# EAGLE design MainBoard (EAGLE 7.7.0)
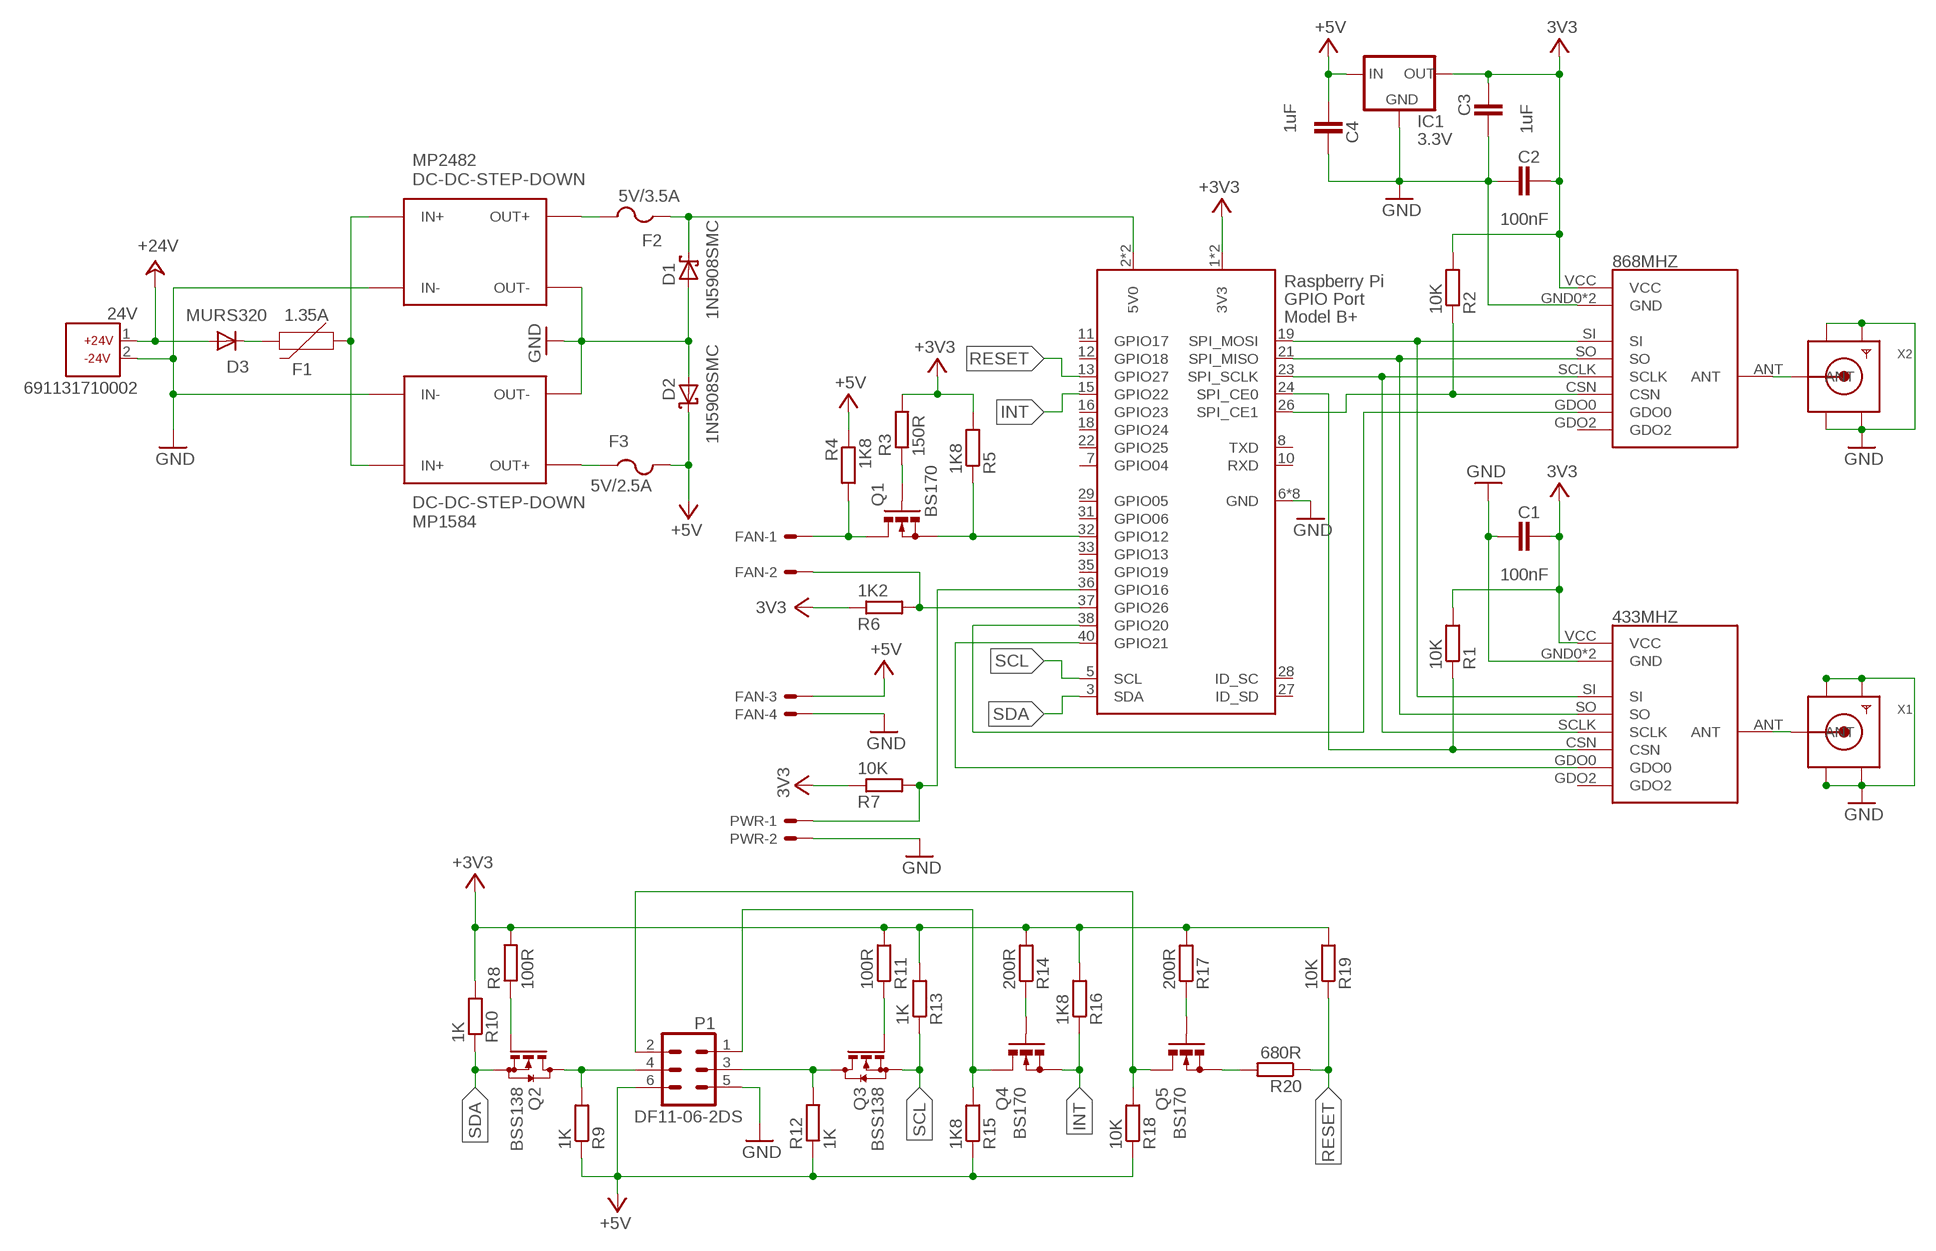
[diagram p0: schematic, sheet 1]

## Parts
24V  691131710002  [691131710002]
433MHZ  CC1101E07-SMD  [E07-M1101S-SMD]
868MHZ  CC1101E07-SMD  [E07-M1101S-SMD]
C1  100nF  C-EUC0805  [C0805]
C2  100nF  C-EUC0805  [C0805]
C3  1uF  C-EUC0805  [C0805]
C4  1uF  C-EUC0805  [C0805]
D1  1N5908SMC  [SMC]
D2  1N5908SMC  [SMC]
D3  MURS320  DIODE-SMC  [SMC]
F1  1.35A  PPTCRGEF250  [RGEF250]
F2  5V/3.5A  PTCFUSE-1812  [1812]
F3  5V/2.5A  PTCFUSE-1812  [1812]
FAN  22-23-2041  [22-23-2041]
IC1  3.3V  MCP1700TRI  [TO92]
MP1584  DC-DC-STEP-DOWN  DC-DC-STEP-DOWNMP1584-V  [MP1584V]
MP2482  DC-DC-STEP-DOWN  DC-DC-STEP-DOWNMP2482-V  [MP2482V]
P1  DF11-06-2DS  [DF11-06DP-2DS]
PWR  22-23-2021  [22-23-2021]
Q1  BS170  [SOT54E]
Q2  BSS138  BSS123  [SOT23]
Q3  BSS138  BSS123  [SOT23]
Q4  BS170  [SOT54E]
Q5  BS170  [SOT54E]
R1  10K  R-EU_0204/2V  [0204V]
R2  10K  R-EU_0204/2V  [0204V]
R3  150R  R-EU_0204/2V  [0204V]
R4  1K8  R-EU_0204/5  [0204/5]
R5  1K8  R-EU_0204/2V  [0204V]
R6  1K2  R-EU_0204/2V  [0204V]
R7  10K  R-EU_0204/2V  [0204V]
R8  100R  R-EU_0204/5  [0204/5]
R9  1K  R-EU_0204/2V  [0204V]
R10  1K  R-EU_0204/5  [0204/5]
R11  100R  R-EU_0204/5  [0204/5]
R12  1K  R-EU_0204/2V  [0204V]
R13  1K  R-EU_0204/5  [0204/5]
R14  200R  R-EU_0204/2V  [0204V]
R15  1K8  R-EU_0204/2V  [0204V]
R16  1K8  R-EU_0204/2V  [0204V]
R17  200R  R-EU_0204/2V  [0204V]
R18  10K  R-EU_0204/2V  [0204V]
R19  10K  R-EU_0204/2V  [0204V]
R20  680R  R-EU_0204/2V  [0204V]
RPI  RASPI_BOARD_B+#_4F  [RASPI_4_BOARD_B+_FULL]
X1  SMACONNECTOR  [SMA90_DIP]
X2  SMACONNECTOR  [SMA90_DIP]

## Nets
5V0: D1.C F2.1 RPI.2(5V0) RPI.4(5V0)
+3V3: R3.2 R5.2 R6.1 R7.1 R8.2 R10.2 R11.2 R13.2 R14.2 R16.2 R17.2 R19.2 RPI.1(3V3) RPI.17(3V3) ; supply symbol labelled 3V3
+5V: C4.2 D2.C F3.2 FAN.3 IC1.2(IN) P1.6 R4.1 R9.1 R12.1 R15.1 R18.1
+24V: 24V.1 D3.A
GND: 24V.2 433MHZ.GND0(GND) 433MHZ.GND1(GND) 868MHZ.GND0(GND) 868MHZ.GND1(GND) C1.2 C2.2 C3.2 C4.1 D1.A D2.A FAN.4 IC1.1(GND) MP1584.IN-0(IN-) MP1584.IN-1(IN-) MP1584.OUT-0(OUT-) MP1584.OUT-1(OUT-) MP2482.IN- MP2482.OUT- P1.5 PWR.2 RPI.6(GND) RPI.9(GND) RPI.14(GND) RPI.20(GND) RPI.25(GND) RPI.30(GND) RPI.34(GND) RPI.39(GND) X1.GND1 X1.GND2 X1.GND3 X1.GND4 X2.GND1 X2.GND2 X2.GND3 X2.GND4
INT: Q4.S R16.1 RPI.15(GPIO22)
N$1: P1.3 Q3.3(D) R12.2
N$2: Q1.G R3.1
N$3: 433MHZ.CSN R1.1 RPI.24(SPI_CE0)
N$4: F2.2 MP2482.OUT+
N$5: Q5.S R20.2
N$6: F3.1 MP1584.OUT+0(OUT+) MP1584.OUT+1(OUT+)
N$7: F1.P$1 MP1584.IN+0(IN+) MP1584.IN+1(IN+) MP2482.IN+
N$8: 433MHZ.ANT X1.ANTENNA(ANT)
N$9: D3.C F1.P$2
N$10: 433MHZ.GDO0 RPI.40(GPIO21)
N$12: P1.4 Q2.3(D) R9.2
N$13: Q1.S R5.1 RPI.32(GPIO12)
N$15: 868MHZ.CSN R2.1 RPI.26(SPI_CE1)
N$16: 433MHZ.SCLK 868MHZ.SCLK RPI.23(SPI_SCLK)
N$17: 433MHZ.SO 868MHZ.SO RPI.21(SPI_MISO)
N$18: 433MHZ.SI 868MHZ.SI RPI.19(SPI_MOSI)
N$19: 868MHZ.GDO0 RPI.38(GPIO20)
N$20: 868MHZ.ANT X2.ANTENNA(ANT)
N$21: PWR.1 R7.2 RPI.36(GPIO16)
N$22: FAN.2 R6.2 RPI.37(GPIO26)
N$23: Q2.1(G) R8.1
N$24: Q3.1(G) R11.1
N$25: P1.1 Q4.D R15.2
N$26: P1.2 Q5.D R18.2
N$27: Q5.G R17.1
N$28: Q4.G R14.1
N$29: FAN.1 Q1.D R4.2
RESET: R19.1 R20.1 RPI.13(GPIO27)
SCL: Q3.2(S) R13.1 RPI.5(SCL)
SDA: Q2.2(S) R10.1 RPI.3(SDA)
VCC: 433MHZ.VCC 868MHZ.VCC C1.1 C2.1 C3.1 IC1.3(OUT) R1.2 R2.2 ; supply symbol labelled 3V3
Unconnected: 433MHZ.GDO2 868MHZ.GDO2 RPI.7(GPIO04) RPI.8(TXD) RPI.10(RXD) RPI.11(GPIO17) RPI.12(GPIO18) RPI.16(GPIO23) RPI.18(GPIO24) RPI.22(GPIO25) RPI.27(ID_SD) RPI.28(ID_SC) RPI.29(GPIO05) RPI.31(GPIO06) RPI.33(GPIO13) RPI.35(GPIO19)

## Notes on the sheet
- +24V
- -24V

## Library data of the parts
24V = con-wuerth:691131710002: WR-TBL Terminal block - CUU5/2 CUU5/2GR - 2 Pins;=>Code : Con_TBL_Screw_PClamp_5.00_6911317100xx_691131710002 <http://katalog.we-online.de/media/images/eican/Con_TBL_Screw_PClamp_5.00_6911317100xx_pf2.jpg> Details see: http://katalog.we-online.de/em/datasheet/6911317100xx.pdf Created 11/23/2014, Karrer Zheng 2014 (C) Wurth Elektronik
433MHZ 868MHZ = modules:CC1101
C1-C4 = rcl:C-EU: CAPACITOR, European symbol
D1 D2 = diode:1N5908: DIODE schottky
D3 = diode:DIODE-: DIODE
F1 = ptc:PPTC: Resettable Fuse PPTC Resettable Fuse. Really a sort of resistor with a polymeric positive temperature coefficient whose resistance increases dramatically with an increase in temperature. When heated by the power passing through the resistance rises causing the current to be limited, protecting the circuit. This is achieved by the transition of the polymer from a crystalline to an amorphous state where the conductive carbon separates breaking the conductive pathways found in the cool crystalline structure. When a PPTC cools back down it resumes conducting letting the circuit turn back on.; PROD_ID: RES-08490; VALUE: 16V/2.5A
F2 F3 = adafruit:PTCFUSE: PTC fuses, resettable thermistors
FAN = con-molex:22-23-2041: .100" (2.54mm) Center Header - 4 Pin; MF: MOLEX; MPN: 22-23-2041; OC_FARNELL: 1462920; OC_NEWARK: 38C0355
IC1 = mcp:MCP1700: Voltage Regulator Source: https://www.microchip.com/en-us/product/MCP1700
MP1584 MP2482 = modules:DC-DC-STEP-DOWN: DC/DC Step-Down Regulator based on MP1584 chip
P1 = con-hirose-df11:DF11-06-2: HEADER
PWR = con-molex:22-23-2021: .100" (2.54mm) Center Header - 2 Pin; MF: MOLEX; MPN: 22-23-2021; OC_FARNELL: 1462926; OC_NEWARK: 25C3832
Q1 Q4 Q5 = transistor-small-signal:BS170: N-CHANNEL MOS FET
Q2 Q3 = transistor-small-signal:BSS123: N-CHANNEL MOS FET
R1-R20 = rcl:R-EU_: RESISTOR, European symbol; OC_FARNELL: unknown
RPI = raspberrypi:RASPI_BOARD_B+#: Raspberry Pi GPIO connector with markings for the outer dimensions of the Raspberry Pi board model B+ with different sets of drill holes or mounting pads All pins connected
X1 X2 = adafruit:SMACONNECTOR: SMA Connector 90° DIP SMA Connector, 50 Ohm (4UConnector: 07259)

## Net classes
0 default: clearance 0.205 mm

## Board
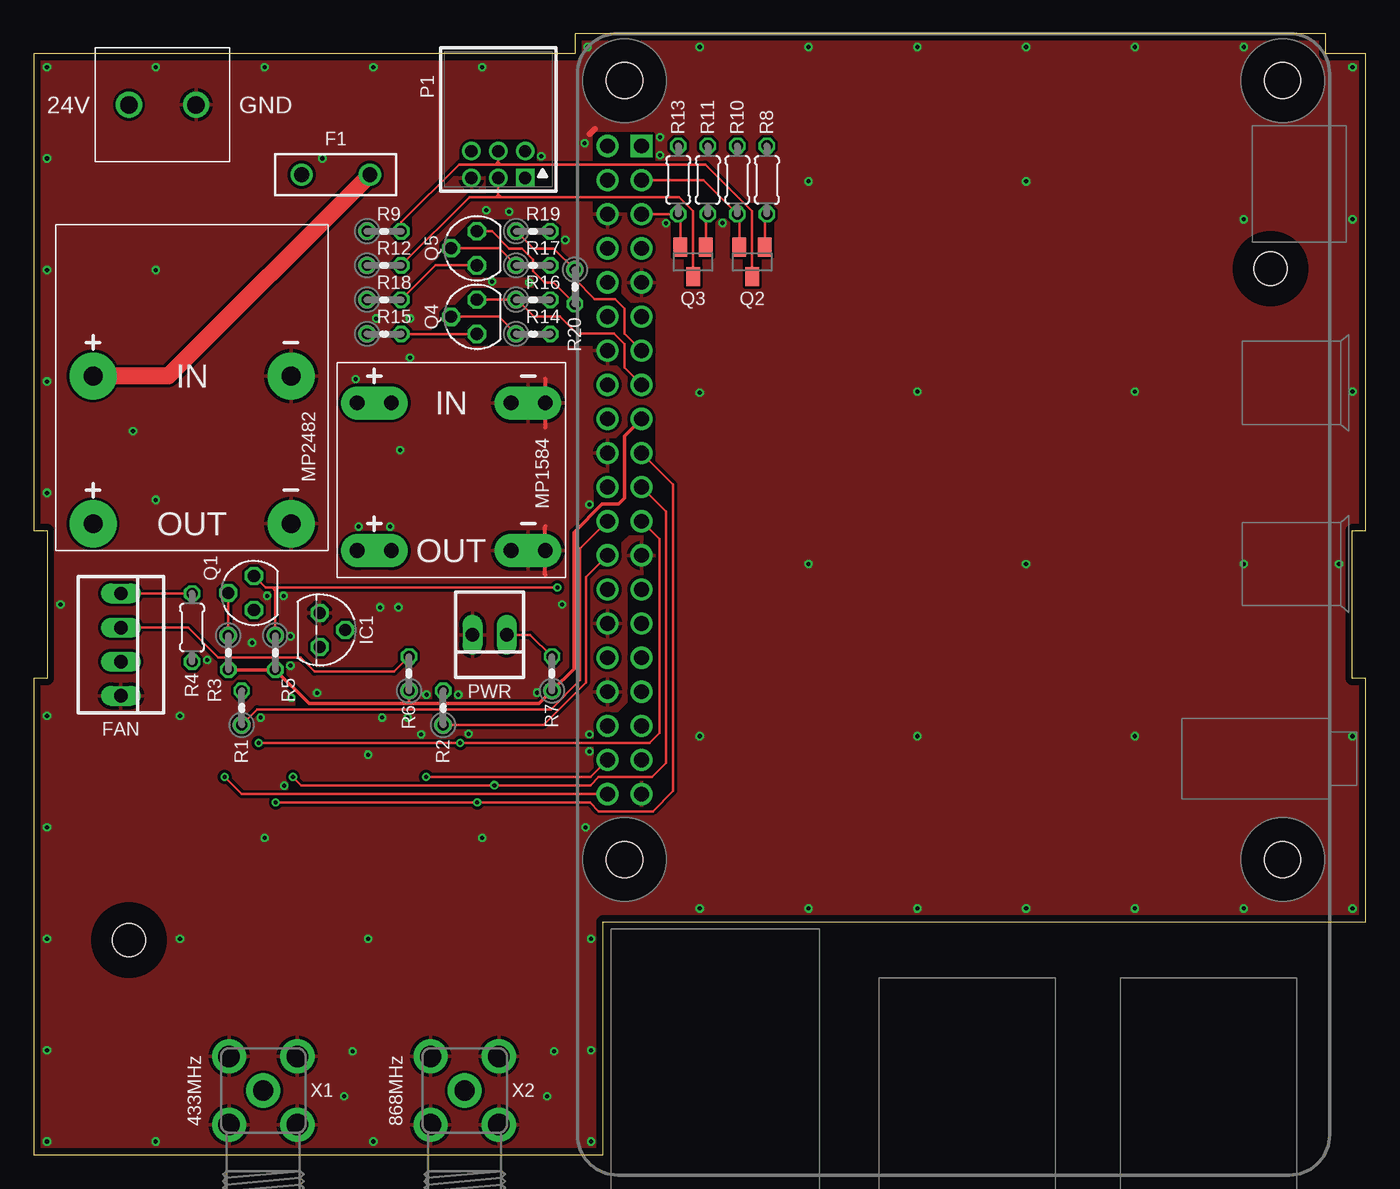
[diagram p1: board, top side]
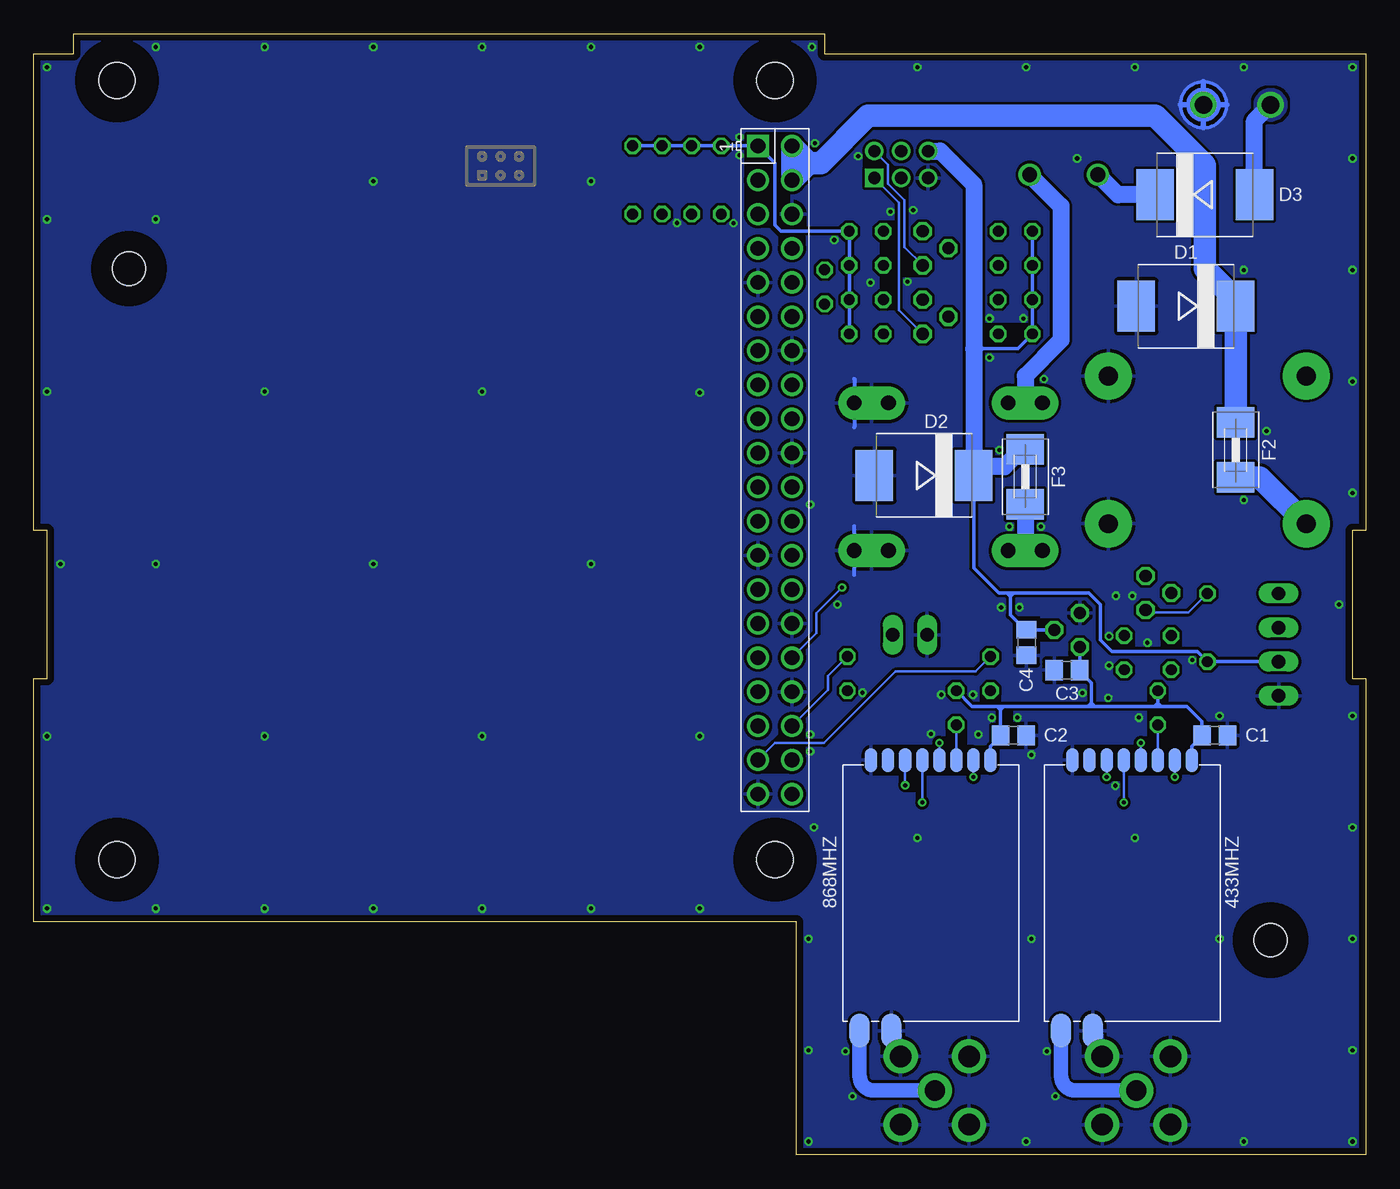
[diagram p2: board, bottom side, seen from below]

Size 99.2 x 83.5 mm. Coordinates in mm from the lower left corner, seen from the top.
Outline: 0,0 42.4,0 42.4,17.35 99.2,17.35 99.2,35.5 98.2,35.5 98.2,46.5 99.2,46.5 99.2,82 96.2,82 96.2,83.5 40.3,83.5 40.3,82 0,82 0,46.5 1,46.5 1,35.5 0,35.5 0,0
Copper layers (1*16): Top 0.035mm / dielectric 1.6mm / Bottom 0.035mm
Design rules "Elecrow *": minimum track width 6mil, minimum drill 12mil, track to track 6mil, track to pad 6mil, pad to pad 12mil, via to via 12mil, smd to smd 0mil, copper to edge 20mil, drill to drill 10mil, minimum pad ring 6mil, minimum via ring 6mil, stop-mask expansion 0mil, vias tented up to drill 100mil, thermal gap 10mil
Holes 2.5 mm at 7.1,16 92.1,66
tRestrict: area 40.9,76.9 to 47.1,83.1; area 89.9,76.9 to 96.1,83.1; area 89.9,18.9 to 96.1,25.1; area 40.9,18.9 to 47.1,25.1; area 89.3,63.2 to 94.9,68.8; area 4.3,13.2 to 9.9,18.8; area 43.9,26.3 to 46.5,27.5; area 41.7,70.2 to 44.5,76.2; area 33.7,71.5 to 34.5,74; area 42.9,58.8 to 45.5,60.1; area 42.9,46.2 to 45.5,53.3; area 41.7,60 to 43,61.5; 63 lines
bRestrict: area 4.3,13.2 to 9.9,18.8; area 89.3,63.2 to 94.9,68.8; area 40.9,76.9 to 47.1,83.1; area 89.9,76.9 to 96.1,83.1; area 40.9,18.9 to 47.1,25.1; area 89.9,18.9 to 96.1,25.1; area 14.2,28.3 to 21.7,30.5; area 29.2,28.3 to 36.7,30.5; area 25.5,30.2 to 27.5,32.3; area 10.5,30.2 to 13.7,32.3; area 10.6,76.7 to 13.6,79.7; area 21,35.1 to 23,37.1; 6 more areas; 64 lines

### Footprints (pad centres in the part's own frame; a part is rotated, then mirrored left to right if it is on the bottom)
691131710002 = drill 1.3: 1 -2.5,0; 2 2.5,0
E07-M1101S-SMD = smd 2.54 x 1.499: ANT 10.25,-5.295; GND1 10.25,-2.945 | smd 1.778 x 0.914: CSN -9.9,1.905; GDO0 -9.9,3.175; GDO2 -9.9,-3.175; GND0 -9.9,-4.445; SCLK -9.9,0.635; SI -9.9,-0.635; SO -9.9,-1.905; VCC -9.9,4.445
C0805 = smd 1.3 x 1.5: 1 -0.95,0; 2 0.95,0
SMC = smd 2.8 x 3.8: A 3.7,0; C -3.7,0
RGEF250 = drill 1.1: P$1 -2.54,0; P$2 2.54,0
1812 = smd 2.286 x 2.794: 1 -2.046,0; 2 2.046,0
22-23-2041 = drill 1 long: 1 -3.81,0; 2 -1.27,0; 3 1.27,0; 4 3.81,0
TO92 = drill 0.9 octagon: 1 -1.27,0; 2 0,1.905; 3 1.27,0
MP1584V = drill 1.1 pad 2.5 offset: IN+0 -2,-4.46; IN-0 -2,4.46; OUT+0 9,-4.46; OUT-0 9,4.46 | drill 1.1: IN+1 -2,-7; IN-1 -2,7; OUT+1 9,-7; OUT-1 9,7
MP2482V = drill 1.4 pad 3.5: IN+ -2,-7.366; IN- -2,7.366; OUT+ 9,-7.366; OUT- 9,7.366
DF11-06DP-2DS = drill 0.914 square: 1 2,-1 | drill 0.914: 2 2,1; 3 0,-1; 4 0,1; 5 -2,-1; 6 -2,1
22-23-2021 = drill 1 long: 1 -1.27,0; 2 1.27,0
SOT54E = drill 0.9 octagon: D -1.27,0; G 0,1.905; S 1.27,0
SOT23 = smd 1 x 1.4: 1 -0.95,-1.1; 2 0.95,-1.1; 3 0,1.1
0204V = drill 0.813 octagon: 1 -1.27,0; 2 1.27,0
0204/5 = drill 0.813 octagon: 1 -2.54,0; 2 2.54,0
RASPI_4_BOARD_B+_FULL = drill 1.1 square: 1 8.37,51.23 | drill 1.1: 2 8.37,53.77; 3 10.91,51.23; 4 10.91,53.77; 5 13.45,51.23; 6 13.45,53.77; 7 15.99,51.23; 8 15.99,53.77; 9 18.53,51.23; 10 18.53,53.77; 11 21.07,51.23; 12 21.07,53.77; 13 23.61,51.23; 14 23.61,53.77; 15 26.15,51.23; 16 26.15,53.77; 17 28.69,51.23; 18 28.69,53.77; 19 31.23,51.23; 20 31.23,53.77; 21 33.77,51.23; 22 33.77,53.77; 23 36.31,51.23; 24 36.31,53.77; 25 38.85,51.23; 26 38.85,53.77; 27 41.39,51.23; 28 41.39,53.77; 29 43.93,51.23; 30 43.93,53.77; 31 46.47,51.23; 32 46.47,53.77; 33 49.01,51.23; 34 49.01,53.77; 35 51.55,51.23; 36 51.55,53.77; 37 54.09,51.23; 38 54.09,53.77; 39 56.63,51.23; 40 56.63,53.77 | hole 2.7: 3.5,3.5; 3.5,52.5; 61.5,3.5; 61.5,52.5
SMA90_DIP = drill 1.5 pad 2.54: ANTENNA 0,0 | drill 1.6 pad 2.54: GND1 -2.54,2.54; GND2 2.54,2.54; GND3 -2.54,-2.54; GND4 2.54,-2.54

### Placement (x,y rotation side)
24V  9.6,78.2 0 top
433MHZ  17.4,19.5 270 bottom
868MHZ  32.4,19.5 270 bottom
C1  11.26,31.25 0 bottom
C2  26.25,31.25 0 bottom
C3  22.25,36.1 180 bottom
C4  25.27,38.15 90 bottom
D1  13.4,63.2 180 bottom
D2  32.9,50.6 180 bottom
D3  12,71.5 0 bottom
F1  22.5,73 180 top
F2  9.7,52.5 270 bottom
F3  25.37,50.5 90 bottom
FAN  6.5,38 270 top
IC1  21.3,39.1 270 top
MP1584  31.1,54 270 top
MP2482  11.8,56 270 top
P1  34.6,73.75 0 top
PWR  33.95,38.73 180 top
Q1  16.41,41.85 90 top
Q2  53.5,66.5 180 top
Q3  49.1,66.5 180 top
Q4  33,62.41 90 top
Q5  33,67.51 90 top
R1  15.49,33.3 90 top
R2  30.5,33.3 90 top
R3  14.5,37.4 270 top
R4  11.8,39.27 90 top
R5  18,37.4 270 top
R6  27.95,35.84 90 top
R7  38.6,35.84 90 top
R8  54.6,72.6 90 top
R9  26.1,68.78 0 top
R10  52.4,72.6 90 top
R11  50.2,72.6 90 top
R12  26.1,66.24 0 top
R13  48,72.6 90 top
R14  37.2,61.14 0 top
R15  26.1,61.14 0 top
R16  37.2,63.68 0 top
R17  37.2,66.24 0 top
R18  26.1,63.68 0 top
R19  37.2,68.78 0 top
R20  40.3,64.64 270 top
RPI  96.5,83.5 270 bottom
X1  17.1,4.8 180 top
X2  32.1,4.8 180 top

### Tracks (layer width: path | path; a pad name or v marks a point on that pad's centre or on a via)
5V0
  Bottom 1.651: RPI.4 41.46,73.86 RPI.2 RPI.4
  Bottom 1.676: F2.1 D1.C 9.7,63.7 12,66 12,73.7 15.68,77.38 37.06,77.38 40.58,73.86 41.46,73.86
+3V3
  Top 0.203: 27.95,33.82 28.15,33.62 29.12,33.62 | R6.1 27.95,33.82 | 27.95,33.82 27.75,33.62 27.34,33.62
  Top 0.254: RPI.17 44,53.54 44,48.91 43.55,48.46 42.34,48.46 40.23,46.35 40.23,36.2 R7.1 37.65,33.62 29.12,33.62 27.34,33.62 20.51,33.62 R5.2 R3.2
  Bottom 0.254: R14.2 R16.2 R17.2 R19.2 43.54,68.78 44,69.24 44,73.86 RPI.1 R13.2 R11.2 R10.2 R8.2
+5V
  Bottom 0.254: IC1.2 C4.2 25.38,39.1 26.48,40.2 26.48,41.6 | R9.1 R12.1 R18.1 R15.1 25.93,60.04 28.5,60.04 | 26.22,41.85 26.73,41.85 | 28.5,60.04 29.04,60.04 | 29.04,60.04 29.2,60.04 | 26.48,41.6 26.22,41.85 | 26.48,41.6 26.73,41.85 | 26.73,41.85 27.34,41.85 29.2,43.71 D2.C | 28.5,60.04 28.77,60.31 | 28.79,60.67 29.04,60.42 29.04,60.04 | 28.5,60.04 28.77,59.77 | FAN.3 R4.1 12.57,37.5 18.91,37.5 19.77,38.35 19.77,40.99 20.62,41.85 26.22,41.85
  Bottom 1.27: F3.2 25.6,52.55 26.9,51.25 29,51.25 29.2,51.05 D2.C 29.2,60.04 29.2,72.26 31.69,74.75 P1.6
+24V
  Bottom 1.27: D3.A 8.3,77 24V.1
  pour Bottom (no thermals): 5.96,78.2 arc-180 8.24,78.2 arc-180
GND  (via drill 0.3)
  Top 0.305: 38.1,57.8 38.1,54.2 | 38.1,43.2 38.1,46.8
  Top 0.406: 41.41,76.02 41.79,76.4
  Bottom 0.254: 10.37,78.2 arc-90 12.1,79.92 arc-90 13.82,78.2 arc-90 12.1,76.48 arc-90 10.37,78.2
  Bottom 0.305: 38.1,57.8 38.1,54.2 | 38.1,43.2 38.1,46.8
  Bottom 0.406: 10.37,78.2 11.1,78.2 24V.2 | 24V.2 13.1,78.2 13.82,78.2 | 12.1,79.92 24V.2 | 24V.2 12.1,76.48
  Bottom 0.54: 11.1,78.2 arc-180 13.1,78.2 arc-180 11.1,78.2
  other vias: 1,1 1,7.8 1,16.1 1,24.4 1,32.7 2,41 1,49.3 1,57.6 1,65.9 1,74.2 1,81 9.1,1 9.1,48.78 9.1,65.9 9.1,81 10.9,16.1 17.2,81 25.3,1 24.9,16.1 17.2,23.6 25.3,81 33.4,23.6 33.4,81 41.5,1 41.5,7.8 41.5,16.1 41.1,24.4 41.38,48.43 41.25,82.5 49.6,18.35 49.6,82.5 57.7,18.35 65.8,31.18 57.7,44.01 57.7,82.5 65.8,18.35 65.8,56.84 65.8,82.5 73.9,18.35 82,31.18 73.9,44.01 73.9,82.5 82,18.35 82,56.84 82,82.5 90.1,18.35 90.1,44.01 90.1,69.67 90.1,82.5 98.2,18.35 98.2,31.18 97.2,44.01 98.2,56.84 98.2,69.67 98.2,81 21.5,74.2 24.2,46.78 41.38,30.05 24.9,29.8 39.35,41 28.02,62.29 25.5,62.29 28.02,59.37 49.6,31.18 28.86,31.32 10.9,32.7 26.54,46.78 7.4,53.9 34.14,65.04 36.9,64.96 38.75,7.71 38.23,4.36 23.75,7.71 23.12,4.36 27.16,40.78 25.79,40.78 73.9,72.5 57.7,72.5 49.6,56.76 41.03,75.34 37.8,74.36 23.98,57.77 27.28,52.5 18.66,27.5 31.62,34.27 32.38,31.36 21.1,34.4 25.94,32.56 37.48,34.42 16.9,32.56 41.38,31.32 35.41,70.25 33.71,70.35 51.3,69.4 46.64,74.44 29.25,34.27 39.59,68.14 27.84,32.56 19.18,34.04 19.12,36.43 18.61,41.63 12.93,36.85 19.12,38.62 16.26,38.14 17.38,41.63 47.09,69.38 46.64,75.8
  pour Bottom (rank 2): 0,83.5 99.2,83.5 99.2,1.5 arc-90 96.2,0 0,0
  pour Top: 0,83.5 99.2,83.5 99.2,0 0,0
INT
  Top 0.203: Q4.S R16.1 36,63.68 37.27,62.41 39.2,62.41 40.45,61.16 43.22,61.16 44,60.38 44,58.62 RPI.15
N$1
  Top 0.203: 34.4,71.32 34.8,71.32 | 34.8,71.32 48.06,71.32 49.1,70.28 Q3.3 | 34.6,71.52 34.8,71.32 | P1.3 34.6,71.52 | 34.6,71.52 34.4,71.32 | R12.2 32.45,71.32 34.4,71.32
N$2
  Top 0.203: Q1.G R3.1
N$3
  Top 0.203: RPI.24 40.7,45.16 40.7,35.36 38.52,33.18 16.64,33.18 R1.1
  Bottom 0.203: R1.1 433MHZ.CSN
N$4
  Bottom 1.676: MP2482.OUT+ 7.89,50.45 F2.2
N$5
  Top 0.203: Q5.S 34.14,68.78 35.42,67.5 36.37,67.5 37.2,66.67 37.2,65.81 38.06,64.95 38.72,64.95 R20.2
N$6
  Bottom 1.27: F3.1 25.37,45.2 25.16,45 MP1584.OUT+1
N$7
  Top 1.27: F1.P$1 10.04,58 MP2482.IN+
  Bottom 1.27: F1.P$1 22.7,70.66 22.7,60.68 25.37,58.01 25.37,56.2 25.16,56 MP1584.IN+1
N$8
  Bottom 1.075: X1.ANTENNA 21.62,4.8 arc90 22.7,5.88 433MHZ.ANT
N$9
  Bottom 1.27: D3.C 18.46,71.5 F1.P$2
N$10  (via drill 0.3)
  Top 0.203: v14.22,28.15 15.51,26.87 RPI.40
  Bottom 0.203: 433MHZ.GDO0 v14.22,28.15
N$12
  Top 0.203: Q2.3 53.5,70.27 50.02,73.75 34.8,73.75 | 34.4,73.75 34.8,73.75 | 34.6,73.95 34.8,73.75 | P1.4 34.6,73.95 | 34.6,73.95 34.4,73.75 | R9.2 27.37,69.45 31.67,73.75 34.4,73.75
N$13  (via drill 0.3)
  Top 0.203: 17.8,42.25 18.2,42.25 | 18.2,42.25 v39,42.25 | Q1.S 17.27,42.25 17.8,42.25 | 18,42.05 18.2,42.25 | R5.1 18,42.05 | 18,42.05 17.8,42.25
  Bottom 0.203: RPI.32 40.91,38.85 40.91,40.34 v39,42.25
N$15
  Top 0.203: RPI.26 41.12,43.04 41.12,35.17 37.98,32.03 R2.1
  Bottom 0.203: 868MHZ.CSN R2.1
N$16  (via drill 0.3)
  Top 0.203: v16.77,30.68 v31.77,30.68 45.86,30.68 46.59,31.41 46.59,45.87 RPI.23
  Bottom 0.203: v31.77,30.68 868MHZ.SCLK | 433MHZ.SCLK v16.77,30.68
N$17  (via drill 0.3)
  Top 0.203: RPI.21 47.1,47.9 47.1,29.21 46.03,28.14 42.08,28.14 41.47,27.53 v34.3,27.53 19.93,27.53 v19.3,28.15
  Bottom 0.203: v34.3,27.53 868MHZ.SO | 433MHZ.SO v19.3,28.15
N$18  (via drill 0.3)
  Top 0.203: RPI.19 47.62,49.92 47.62,27.11 46.11,25.6 42.08,25.6 41.43,26.25 v33.03,26.25 v18.04,26.25
  Bottom 0.203: 868MHZ.SI v33.03,26.25 | 433MHZ.SI v18.04,26.25
N$19  (via drill 0.3)
  Top 0.203: v29.23,28.15 41.47,28.15 RPI.38
  Bottom 0.203: 868MHZ.GDO0 v29.23,28.15
N$20
  Bottom 1.075: X2.ANTENNA 36.62,4.8 arc90 37.7,5.88 868MHZ.ANT
N$21
  Top 0.203: PWR.1 36.98,38.73 R7.2
  Bottom 0.203: R7.2 40.05,35.66 40.05,34.63 RPI.36
N$22
  Top 0.203: R6.2 26.84,36 20.92,36 19.87,37.05 13.74,37.05 11.52,39.27 FAN.2
  Bottom 0.203: RPI.37 44,30.68 40.35,30.68 35.03,36 29.06,36 R6.2
N$23
  Top 0.203: R8.1 54.45,69.91 Q2.1
N$24
  Top 0.203: R11.1 50.05,69.91 Q3.1
N$25
  Top 0.203: R15.2 Q4.D
  Bottom 0.203: Q4.D 34.77,62.91 34.77,70.92 P1.1
N$26
  Top 0.203: R18.2 29.93,66.24 Q5.D
  Bottom 0.203: Q5.D 34.35,67.59 34.35,71.08 35.6,72.33 35.6,73.75 P1.2
N$27
  Top 0.203: Q5.G 34.66,67.51 R17.1
N$28
  Top 0.203: Q4.G 34.66,62.41 R14.1
N$29
  Top 0.203: FAN.1 R4.2
  Bottom 0.203: Q1.D 16.23,40.4 13.21,40.4 R4.2
RESET
  Top 0.203: RPI.13 44,61.16 44,63.01 43.28,63.73 41.77,63.73 40.3,65.2 R20.1 38.71,67.5 37.21,67.5 R19.1
SCL
  Top 0.203: RPI.5 R13.1 48.15,69.91 Q3.2
SDA
  Top 0.203: Q2.2 52.55,69.91 R10.1 49.87,72.59 RPI.3
VCC
  Bottom 0.254: IC1.3 C3.1 21.3,36 20.45,35.15 20.45,33.65 | 20.2,33.4 20.7,33.4 | 20.45,33.65 20.7,33.4 | 20.45,33.65 20.2,33.4 | 15.24,33.4 13.34,33.4 12.21,32.27 C1.1 12.21,31.16 12.96,30.41 433MHZ.VCC | 15.24,33.4 15.75,33.4 | 15.75,33.4 20.2,33.4 | 868MHZ.VCC 27.95,30.41 27.2,31.16 C2.1 27.2,33.15 | 20.7,33.4 26.95,33.4 | 26.95,33.4 27.46,33.4 | 27.46,33.4 29.32,33.4 R2.2 | 27.2,33.15 27.46,33.4 | 27.2,33.15 26.95,33.4 | 15.49,33.65 15.75,33.4 | R1.2 15.49,33.65 | 15.49,33.65 15.24,33.4

### Text on the board
tNames: GND | 433MHz | 868MHz
bDocu: 5.0V | SDA | RESET | P1 | GND | SCL | INT | Automation board / V1.7